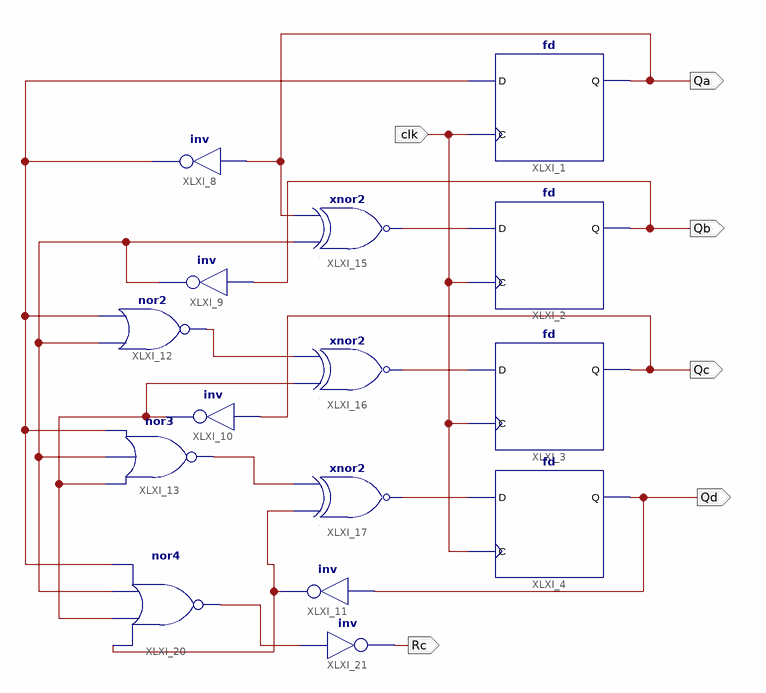
[diagram p0: schematic sheet 1]
// Xilinx ISE schematic Counter_4bit.sch (kintex7) as structural Verilog: 15 symbols, 6 ports
module Counter_4bit (
  input  clk,
  output Qa,
  output Qb,
  output Qc,
  output Qd,
  output Rc
);

  wire XLXN_9, XLXN_10, XLXN_11, XLXN_12, XLXN_13, XLXN_21, XLXN_23, XLXN_27, XLXN_30, XLXN_33;

  fd XLXI_1 (.C(clk), .D(XLXN_23), .Q(Qa));
  fd XLXI_2 (.C(clk), .D(XLXN_11), .Q(Qb));
  fd XLXI_3 (.C(clk), .D(XLXN_10), .Q(Qc));
  fd XLXI_4 (.C(clk), .D(XLXN_9), .Q(Qd));
  not XLXI_8 (XLXN_23, Qa);
  not XLXI_9 (XLXN_27, Qb);
  not XLXI_10 (XLXN_30, Qc);
  not XLXI_11 (XLXN_21, Qd);
  nor XLXI_12 (XLXN_12, XLXN_27, XLXN_23);
  nor XLXI_13 (XLXN_13, XLXN_30, XLXN_27, XLXN_23);
  xnor XLXI_15 (XLXN_11, XLXN_27, Qa);
  xnor XLXI_16 (XLXN_10, XLXN_30, XLXN_12);
  xnor XLXI_17 (XLXN_9, XLXN_21, XLXN_13);
  nor XLXI_20 (XLXN_33, XLXN_21, XLXN_30, XLXN_27, XLXN_23);
  not XLXI_21 (Rc, XLXN_33);
endmodule
